# Altium project CoreBoard.PrjPcb
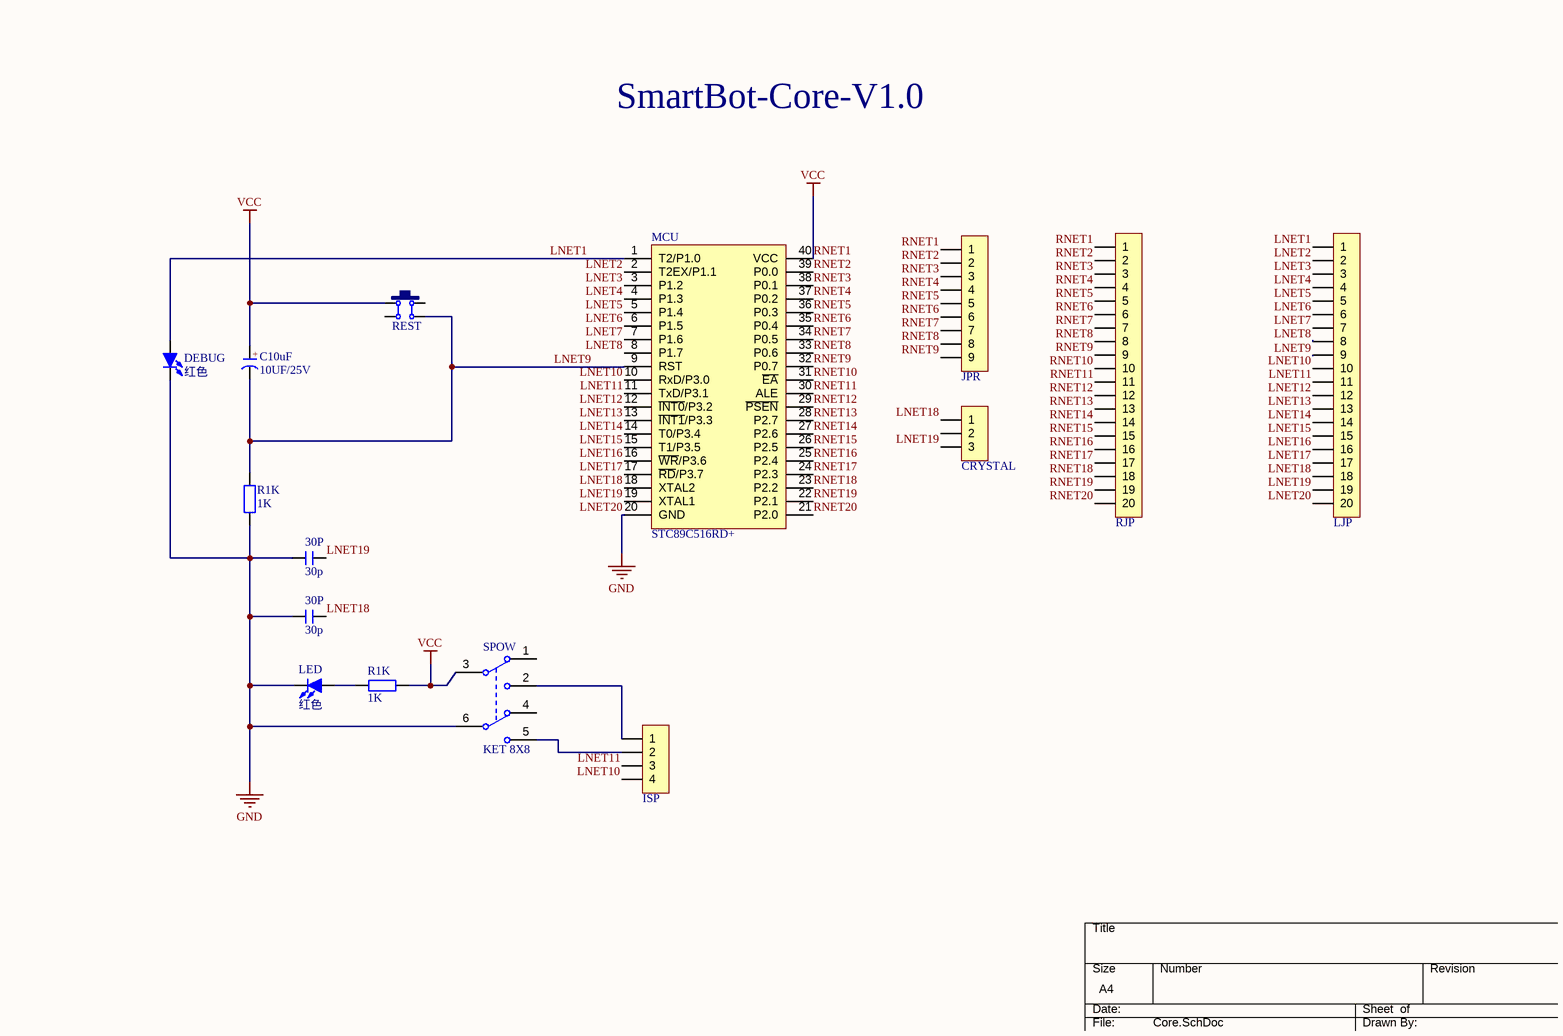
[diagram p0: Core.SchDoc]
1 sheet, 15 parts. Net scope: global (net labels, ports and power ports of the same name join across sheets).
Board files: Template.PcbDoc, Core.PcbDoc

## Sheet Core.SchDoc: 51核心板原理图
size A4; SheetNumber: 1; SheetTotal: 1

### Parts
(Parts that share a designator on the sheet are numbered #1, #2 ... from top to bottom, then left to right.)
30P#1  30p  [CC 1.8*3.6]
30P#2  30p  [CC 1.8*3.6]
C10uF  10UF/25V  [CAP 2.0*5*11]
CRYSTAL  HDR-1X3  [HDR-1X3_Y]  (value not drawn)
DEBUG  红色  [LED 5MM-R]
ISP  HDR-1X4  [HDR-1X4-ISP]  (value not drawn)
JPR  HDR-1X9  [HDR-1X9_Y]  (value not drawn)
LED  红色  [LED 5MM-R]
LJP  HDR-1X20_TEXT  [HDR-1X20_TEXT]  (value not drawn)
MCU  STC89C516RD+  [DIP40-600]
R1K#1  1K  [RS 1/4W]
R1K#2  1K  [RS 1/4W]
REST  6x6x5  [TSW DIP-6*6*4.3]  (value not drawn)
RJP  HDR-1X20_TEXTR  [HDR-1X20_TEXTR]  (value not drawn)
SPOW  KET 8X8  [KFT DIP-8X8]

### Nets
LNET20: 30P#1.1 30P#2.1 DEBUG.2(K) LED.2(K) LJP.20 MCU.20(GND) R1K#1.1 SPOW.6(NC2)  [also labelled GND]
RNET1: C10uF.1(A) JPR.1 MCU.40(VCC) R1K#2.2 REST.1 RJP.1 SPOW.3(NO1)  [also labelled VCC]
LNET1: DEBUG.1(A) LJP.1 MCU.1(T2/P1.0)
LNET2: LJP.2 MCU.2(T2EX/P1.1)
LNET3: LJP.3 MCU.3(P1.2)
LNET4: LJP.4 MCU.4(P1.3)
LNET5: LJP.5 MCU.5(P1.4)
LNET6: LJP.6 MCU.6(P1.5)
LNET7: LJP.7 MCU.7(P1.6)
LNET8: LJP.8 MCU.8(P1.7)
LNET9: C10uF.2(K) LJP.9 MCU.9(RST) R1K#1.2 REST.3
LNET10: ISP.4 LJP.10 MCU.10(RxD/P3.0)
LNET11: ISP.3 LJP.11 MCU.11(TxD/P3.1)
LNET12: LJP.12 MCU.12(~{INT0}/P3.2)
LNET13: LJP.13 MCU.13(~{INT1}/P3.3)
LNET14: LJP.14 MCU.14(T0/P3.4)
LNET15: LJP.15 MCU.15(T1/P3.5)
LNET16: LJP.16 MCU.16(~{WR}/P3.6)
LNET17: LJP.17 MCU.17(~{RD}/P3.7)
LNET18: 30P#2.2 CRYSTAL.1 LJP.18 MCU.18(XTAL2)
LNET19: 30P#1.2 CRYSTAL.3 LJP.19 MCU.19(XTAL1)
RNET2: JPR.2 MCU.39(P0.0) RJP.2
RNET3: JPR.3 MCU.38(P0.1) RJP.3
RNET4: JPR.4 MCU.37(P0.2) RJP.4
RNET5: JPR.5 MCU.36(P0.3) RJP.5
RNET6: JPR.6 MCU.35(P0.4) RJP.6
RNET7: JPR.7 MCU.34(P0.5) RJP.7
RNET8: JPR.8 MCU.33(P0.6) RJP.8
RNET9: JPR.9 MCU.32(P0.7) RJP.9
RNET10: MCU.31(~{EA}) RJP.10
RNET11: MCU.30(ALE) RJP.11
RNET12: MCU.29(~{PSEN}) RJP.12
RNET13: MCU.28(P2.7) RJP.13
RNET14: MCU.27(P2.6) RJP.14
RNET15: MCU.26(P2.5) RJP.15
RNET16: MCU.25(P2.4) RJP.16
RNET17: MCU.24(P2.3) RJP.17
RNET18: MCU.23(P2.2) RJP.18
RNET19: MCU.22(P2.1) RJP.19
RNET20: MCU.21(P2.0) RJP.20
NetISP_1: ISP.1 SPOW.2(COM2)
NetISP_2: ISP.2 SPOW.5(COM2)
NetLED_1: LED.1(A) R1K#2.1

Not connected (* = marked no-connect by the designer): CRYSTAL 2; REST 2 4; SPOW 1(NC1) 4(NO2)

### Notes on the sheet
- SmartBot-Core-V1.0
- THIS DOCUMENT AND THE DATA DISCLOSED HEREIN OR
- HEREWITH IS THE PROPERTY OF ALTIUM LIMITED AND MAY
- DWG NO:
- REVISION
- REV:
- DESCRIPTION
- DATE
- APPROVED
- BE FREELY DISTRIBUTED IN WHOLE. NO RIGHTS ARE
- RESERVED OR EXPRESS OR IMPLIED WARANTEE GIVEN.
- ENG:
- APPROVALS
- PROJECT
- DSN:
- CHK:
- REFERENCE DOCUMENTS
- PROJECT REVISION:
- TITLE
- DOCUMENT REVISION:
- DESIGN ITEM:
- BOM:
- FAB DWG:
- PCB DWG:
- ASSY DWG:
- SCALE:
- A3
- SIZE
- CAGE CODE
- FILE NAME
- DWG NO.
- SHEET
- OF
- REV
- (in symbol C-CAP) +

### Library data of the parts
30P#1 30P#2 = C-CC: 直插瓷片电容; 版权归属: 源创客; BOM名称: 直插瓷片电容; 学习资源: www.ooocke.com
C10uF = C-CAP: 直插电解电容; 版权归属: 源创客; Value: 1n; BOM名称: 直插电解电容; 学习资源: www.ooocke.com
CRYSTAL = Header 3: 3P接插件; 版权归属: 源创客; BOM名称: 3P接插件; 学习资源: www.ooocke.com
DEBUG LED = LED-5MM: 5mm插件LED; 版权归属: 源创客; Value: 1u; BOM名称: 5mm插件LED; 学习资源: www.ooocke.com
ISP = Header 4: 4P接插件; 版权归属: 源创客; BOM名称: 4P接插件; 学习资源: www.ooocke.com
JPR = Header 9: 9P接插件; 版权归属: 源创客; BOM名称: 9P接插件; 学习资源: www.ooocke.com
LJP RJP = Header 20_TEXT: 20P接插件; 版权归属: 源创客; BOM名称: 20P接插件; 学习资源: www.ooocke.com
MCU = STC89C516RD+: STC单片机; 版权归属: 源创客; BOM名称: STC单片机; 学习资源: www.ooocke.com
R1K#1 R1K#2 = R-CRR: 直插色环电阻; BOM名称: 色环电阻; 版权归属: 源创客; 学习资源: www.ooocke.com; Value: 1K
REST = TSW DIP-6x6: 直插6x6轻触开关; 版权归属: 源创客; Value: 1K; BOM名称: 直插6x6轻触开关; 学习资源: www.ooocke.com
SPOW = KET 8X8: 8*8自锁开关; 版权归属: 源创客; BOM名称: 8*8自锁开关; 学习资源: www.ooocke.com